# Altium schematic sheet ETH-PHY_SGMII.SchDoc
size A4; Organization: UltraZohm; SheetNumber: 11; SheetTotal: 15
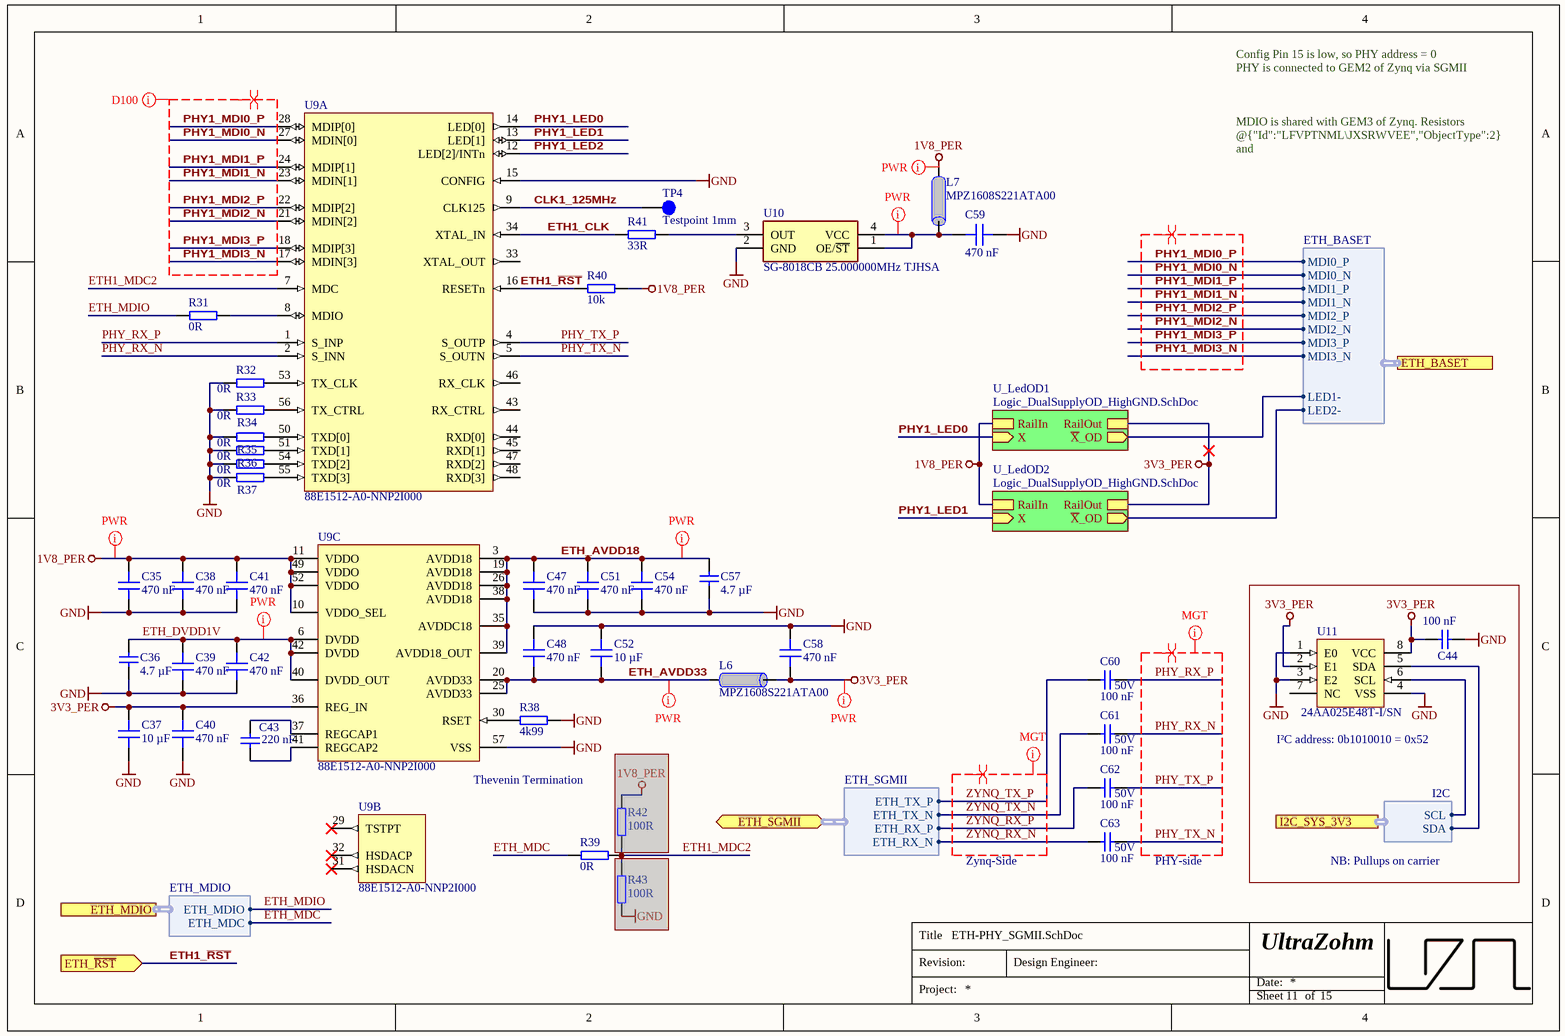
[diagram p0: ETH-PHY_SGMII.SchDoc]

## Parts
C35  470 nF  [C_0603_TE]
C36  4.7 µF  [C_0603_TE]
C37  10 µF  [C_0603_TE]
C38  470 nF  [C_0603_TE]
C39  470 nF  [C_0603_TE]
C40  470 nF  [C_0603_TE]
C41  470 nF  [C_0603_TE]
C42  470 nF  [C_0603_TE]
C43  220 nF  [C_0603_TE]
C44  100 nF  [C_0603_TE]
C47  470 nF  [C_0603_TE]
C48  470 nF  [C_0603_TE]
C51  470 nF  [C_0603_TE]
C52  10 µF  [C_0603_TE]
C54  470 nF  [C_0603_TE]
C57  4.7 µF  [C_0603_TE]
C58  470 nF  [C_0603_TE]
C59  470 nF  [C_0603_TE]
C60  100 nF  Voltage: 50V  [C_0402_TE]
C61  100 nF  Voltage: 50V  [C_0402_TE]
C62  100 nF  Voltage: 50V  [C_0402_TE]
C63  100 nF  Voltage: 50V  [C_0402_TE]
L6  MPZ1608S221ATA00  [RES 0603_1608]
L7  MPZ1608S221ATA00  [RES 0603_1608]
R31  0R  [R_0603_TE]
R32  0R  [R_0603_TE]
R33  0R  [R_0603_TE]
R34  0R  [R_0603_TE]
R35  0R  [R_0603_TE]
R36  0R  [R_0603_TE]
R37  0R  [R_0603_TE]
R38  4k99  [RES 0603_1608]
R39  0R  [R_0603_TE]
R40  10k  [R_0603_TE]
R41  33R  [R_0603_TE]
R42  100R  [R_0603_TE]  (masked out: inside a compile mask, not in the netlist)
R43  100R  [R_0603_TE]  (masked out: inside a compile mask, not in the netlist)
TP4  Testpoint 1mm  [TP_1mm]  (no BOM)
U9  88E1512-A0-NNP2I000  [QFN50P800X800X100-57N]  (parts A,B,C of 3)
U10  SG-8018CB 25.000000MHz TJHSA  [SMD5032-4P]
U11  24AA025E48T-I/SN  [D0008A_N]

## Sub-sheets
U_LedOD1 = Logic_DualSupplyOD_HighGND.SchDoc: RailIn, RailOut, X (in), ~{X}_OD (out)
U_LedOD2 = Logic_DualSupplyOD_HighGND.SchDoc: RailIn, RailOut, X (in), ~{X}_OD (out)

## Ports
ETH_BASET (harness ETH_BASET), ETH_MDIO (harness ETH_MDIO), ETH_SGMII (bidir, harness ETH_SGMII), ETH_~{RST} (in), I2C_SYS_3V3 (harness I2C)

## Harnesses
ETH_SGMII: ETH_RX_N, ETH_RX_P, ETH_TX_N, ETH_TX_P
ETH_MDIO: ETH_MDC, ETH_MDIO
ETH_BASET: MDI0_P, MDI0_N, MDI1_P, MDI1_N, MDI2_P, MDI2_N, MDI3_P, MDI3_N, LED1-, LED2-
I2C: SCL, SDA

## Nets
1V8_PER: C35.1 C38.1 C41.1 L7.1 R40.2 U9.10(VDDO_SEL) U9.11(VDDO) U9.49(VDDO) U9.52(VDDO) ; sheet U_LedOD1/RailIn, sheet U_LedOD2/RailIn
3V3_PER: C37.1 C40.1 C44.1 C58.2 L6.2 U9.36(REG_IN) U11.2(E1) U11.8(VCC) ; sheet U_LedOD1/RailOut, sheet U_LedOD2/RailOut
GND: C35.2 C36.2 C37.2 C38.2 C39.2 C40.2 C41.2 C42.2 C44.2 C47.2 C48.1 C51.2 C52.1 C54.2 C57.2 C58.1 C59.1 R32.1 R33.1 R34.1 R35.1 R36.1 R37.1 R38.1 U9.15(CONFIG) U9.57(VSS) U10.2(GND) U11.1(E0) U11.3(E2) U11.4(VSS)
CLK1_125MHz: TP4.1 U9.9(CLK125)
ETH1_CLK: R41.1 U9.34(XTAL_IN)
ETH1_MDC2: R39.2 U9.7(MDC)
ETH1_~{RST}: R40.1 U9.16(RESETn) ; port ETH_~{RST}
ETH_AVDD18: C47.1 C51.1 C54.1 C57.1 U9.3(AVDD18) U9.19(AVDD18) U9.26(AVDD18) U9.35(AVDDC18) U9.38(AVDD18) U9.39(AVDD18_OUT)
ETH_AVDD33: C48.2 C52.2 L6.1 U9.20(AVDD33) U9.25(AVDD33)
ETH_DVDD1V: C36.1 C39.1 C42.1 U9.6(DVDD) U9.40(DVDD_OUT) U9.42(DVDD)
ETH_MDC: R39.1 ; port ETH_MDIO.ETH_MDC
ETH_MDIO: R31.1 ; port ETH_MDIO.ETH_MDIO
PHY1_LED0: U9.14(LED[0]) ; sheet U_LedOD1/X
PHY1_LED1: U9.13(LED[1]) ; sheet U_LedOD2/X
PHY1_LED2: U9.12(LED[2]/INTn)
PHY1_MDI0_N: U9.27(MDIN[0]) ; port ETH_BASET.MDI0_N
PHY1_MDI0_P: U9.28(MDIP[0]) ; port ETH_BASET.MDI0_P
PHY1_MDI1_N: U9.23(MDIN[1]) ; port ETH_BASET.MDI1_N
PHY1_MDI1_P: U9.24(MDIP[1]) ; port ETH_BASET.MDI1_P
PHY1_MDI2_N: U9.21(MDIN[2]) ; port ETH_BASET.MDI2_N
PHY1_MDI2_P: U9.22(MDIP[2]) ; port ETH_BASET.MDI2_P
PHY1_MDI3_N: U9.17(MDIN[3]) ; port ETH_BASET.MDI3_N
PHY1_MDI3_P: U9.18(MDIP[3]) ; port ETH_BASET.MDI3_P
PHY_RX_N: C61.2 U9.2(S_INN)
PHY_RX_P: C60.2 U9.1(S_INP)
PHY_TX_N: C63.2 U9.5(S_OUTN)
PHY_TX_P: C62.2 U9.4(S_OUTP)
ZYNQ_RX_N: C63.1 ; port ETH_SGMII.ETH_RX_N
ZYNQ_RX_P: C62.1 ; port ETH_SGMII.ETH_RX_P
ZYNQ_TX_N: C61.1 ; port ETH_SGMII.ETH_TX_N
ZYNQ_TX_P: C60.1 ; port ETH_SGMII.ETH_TX_P
NetC43_1: C43.1 U9.37(REGCAP1)
NetC43_2: C43.2 U9.41(REGCAP2)
NetC59_2: C59.2 L7.2 U10.1(OE/~{ST}) U10.4(VCC)
NetR31_2: R31.2 U9.8(MDIO)
NetR32_2: R32.2 U9.53(TX_CLK)
NetR33_2: R33.2 U9.56(TX_CTRL)
NetR34_2: R34.2 U9.50(TXD[0])
NetR35_2: R35.2 U9.51(TXD[1])
NetR36_2: R36.2 U9.54(TXD[2])
NetR37_2: R37.2 U9.55(TXD[3])
NetR38_2: R38.2 U9.30(RSET)
NetR41_2: R41.2 U10.3(OUT)
NetU11_5: U11.5(SDA) ; port I2C_SYS_3V3.SDA
NetU11_6: U11.6(SCL) ; port I2C_SYS_3V3.SCL
(unnamed): sheet U_LedOD1/~{X}_OD, port ETH_BASET.LED1-
(unnamed): sheet U_LedOD2/~{X}_OD, port ETH_BASET.LED2-

Not connected (* = marked no-connect by the designer): U9 29(TSTPT)* 31(HSDACN)* 32(HSDACP)* 33(XTAL_OUT) 43(RX_CTRL) 44(RXD[0]) 45(RXD[1]) 46(RX_CLK) 47(RXD[2]) 48(RXD[3]); U11 7(NC)

## Layout directives
differential pair: PHY1_MDI0_N, PHY1_MDI0_P, PHY1_MDI1_N, PHY1_MDI1_P, PHY1_MDI2_N, PHY1_MDI2_P, PHY1_MDI3_N, PHY1_MDI3_P, PHY_RX_N, PHY_RX_P, PHY_TX_N, PHY_TX_P, ZYNQ_RX_N, ZYNQ_RX_P, ZYNQ_TX_N, ZYNQ_TX_P
net class D100: PHY1_MDI0_N, PHY1_MDI0_P, PHY1_MDI1_N, PHY1_MDI1_P, PHY1_MDI2_N, PHY1_MDI2_P, PHY1_MDI3_N, PHY1_MDI3_P
net class MGT: PHY_RX_N, PHY_RX_P, PHY_TX_N, PHY_TX_P, ZYNQ_RX_N, ZYNQ_RX_P, ZYNQ_TX_N, ZYNQ_TX_P
net class PWR: 1V8_PER, 3V3_PER, ETH_AVDD18, ETH_AVDD33, ETH_DVDD1V, NetC59_2

## Notes on the sheet
- Config Pin 15 is low, so PHY address = 0
  PHY is connected to GEM2 of Zynq via SGMII
  MDIO is shared with GEM3 of Zynq. Resistors @{"Id":"LFVPTNML\JXSRWVEE","ObjectType":2} and @{"Id":"LFVPTNML\HYAPWXBM","ObjectType":2} need to be soldered with 0R to be connected to the MDIO Bus
- Thevenin Termination
- (near U11) I²C address: 0b1010010 = 0x52
- Zynq-Side
- (near C63) PHY-side
- NB: Pullups on carrier
- Title
- Revision:
- Design Engineer:
- Date:
- Project:
- Sheet
- of

## Library data of the parts
C35 C38-C42 C47 C48 C51 C54 C58 C59 = CL10A474KB8NNNC: Capacitor 0603, 50 VDC, 470 nF, X5R; Manufacturer: Samsung Electro-Mechanics; Tolerance: 10 %; Voltage Rating: 50 VDC; Created from: AGeiger; Manufacturer Part Number: CL10A474KB8NNNC; PartID: 103; Created On: 22/08/2022 14:44:45; ComponentLink1Description: Datasheet; ComponentLink1URL: https://datasheet.lcsc.com/lcsc/1810191213_Samsung-Electro-Mechanics-CL10A474KB8NNNC_C170149.pdf; Component Type: Capacitor 0603; Device Package: 0603; Last Updated: 22/04/2025 15:48:45; Mounting Type: SMD; Operating Temperature: -55 - 85°C; Series: X5R; Supplier 1: LCSC; Supplier Part Number 1: C170149; Supplier 2: Mouser; Supplier Part Number 2: 187-CL10A474KB8NNNC; Type: Capacitor; Value: 470 nF; Live Cycle Status: 1; LCSC Part Number: C170149
C36 C57 = UZgen_C_0603_4.7uF_16V_X5R: Generic capacitor; Manufacturer: UZgen; Tolerance: 10 %; Created from: MGeier; Voltage: 16V; Manufacturer Part Number: UZgen_C_0603_4.7uF_16V_X5R; PartID: 5809; Created On: 20/03/2025 14:43:45; Device Package: 0603; Last Updated: 20/03/2025 14:43:45; Mounting Type: SMD; Value: 4.7 µF; Technology: X5R
C37 C52 = CL10A106MO8NQNC: Capacitor 0603, 16 VDC, 10 µF, X5R; Manufacturer: Samsung Electro-Mechanics; Tolerance: 20 %; Voltage Rating: 16 VDC; Created from: AGeiger; Manufacturer Part Number: CL10A106MO8NQNC; PartID: 101; Created On: 22/08/2022 13:56:44; ComponentLink1Description: Datasheet; ComponentLink1URL: https://datasheet.lcsc.com/lcsc/1810261909_Samsung-Electro-Mechanics-CL10A106MO8NQNC_C92487.pdf; Component Type: Capacitor 0603; Device Package: 0603; Last Updated: 19/11/2024 12:40:46; Mounting Type: SMD; Operating Temperature: -55 - 85°C; Series: X5R; Supplier 1: LCSC; Supplier Part Number 1: C92487; Type: Capacitor; Value: 10 µF; Live Cycle Status: 1; LCSC Part Number: C92487
C43 = UZgen_C_0603_220nF_50V_X7R: Generic capacitor; Manufacturer: UZgen; Tolerance: 10 %; Voltage: 50V; Created from: UZgenTool; Value: 220 nF; Technology: X7R; Manufacturer Part Number: UZgen_C_0603_220nF_50V_X7R; PartID: 2; Created On: 02/07/2024 14:42:23; Device Package: 0603; Mounting Type: SMD; Last Updated: 08/08/2024 15:01:15
C44 = UZgen_C_0603_100nF_50V_X7R: Generic capacitor; Manufacturer: UZgen; Voltage: 50V; Tolerance: 10 %; Created from: AGeiger; Manufacturer Part Number: UZgen_C_0603_100nF_50V_X7R; PartID: 1; Created On: 02/07/2024 14:42:23; Value: 100 nF; Device Package: 0603; Technology: X7R; Mounting Type: SMD; Last Updated: 08/08/2024 15:01:15
C60-C63 = UZgen_C_0402_100nF_50V_X7R: Generic capacitor; Manufacturer: UZgen; Tolerance: 10 %; Created from: UZgenTool; Technology: X7R; Value: 100 nF; Manufacturer Part Number: UZgen_C_0402_100nF_50V_X7R; PartID: 3431; Created On: 02/08/2024 11:17:51; Device Package: 0402; Mounting Type: SMD; Last Updated: 02/08/2024 11:17:51
L6 L7 = MPZ1608S221ATA00: Ferritperle, 0603, 220 ohm, 2.2 A, Baureihe MPZ, 0.05 ohm, ± 25%; Manufacturer: TDK; Value: 220 Ohm; Type: Ferrite; DC current: 2.2 A; Created from: MGremer; Manufacturer Part Number: MPZ1608S221ATA00; PartID: 3; Created On: 08/06/2021 11:33:39; ComponentLink1Description: Datasheet; ComponentLink1URL: http://www.farnell.com/datasheets/2291439.pdf; Component Type: Ferritperle; Device Package: 0603; Last Updated: 12/07/2024 17:26:54; Mounting Type: SMD; Operating Temperature: -55 - 125 °C; Series: MPZ; Supplier 1: Farnell; Supplier Part Number 1: 1301677RL; Live Cycle Status: 1; LCSC Part Number: C76815; Stock number: not stored
R31-R37 R39 = UZgen_R_0603_0R: Generic resistor; Manufacturer: UZgen; Tolerance: 1 %; Created from: UZgenTool; Value: 0R; Manufacturer Part Number: UZgen_R_0603_0R; PartID: 581; Created On: 08/07/2024 14:34:30; Device Package: 0603; Mounting Type: SMD; Last Updated: 08/07/2024 14:34:30
R38 = RC0603FR-074K99L: 100mW Thick Film Resistors 75V ±100ppm/℃ ±1% 4.99kΩ 0603 Chip Resistor - Surface Mount ROHS; Manufacturer: YAGEO; Created from: NDiringer; Tolerance: 1%; Value: 4k99; Manufacturer Part Number: RC0603FR-074K99L; PartID: 352; Created On: 17/08/2022 08:08:34; ComponentLink1Description: Datasheet; ComponentLink1URL: https://www.lcsc.com/datasheet/lcsc_datasheet_2304140030_YAGEO-RC0603FR-074K99L_C114621.pdf; Component Type: SMD resistor; Device Package: 0603; Last Updated: 17/08/2022 08:08:34; Mounting Type: SMD; Supplier 1: LCSC/JLCPCB; Supplier Part Number 1: C114621; Type: Resistor; Live Cycle Status: 1; Stock number: not stored; LCSC Part Number: C114621
R40 = UZgen_R_0603_10k: Generic resistor; Manufacturer: UZgen; Tolerance: 1 %; Created from: AGeiger; Value: 10k; Manufacturer Part Number: UZgen_R_0603_10k; PartID: 1; Created On: 02/07/2024 14:34:53; Device Package: 0603; Mounting Type: SMD; Last Updated: 02/07/2024 14:37:16
R41 = UZgen_R_0603_33R: Generic resistor; Manufacturer: UZgen; Tolerance: 1 %; Created from: UZgenTool; Value: 33R; Manufacturer Part Number: UZgen_R_0603_33R; PartID: 185; Created On: 02/07/2024 17:29:48; Device Package: 0603; Mounting Type: SMD; Last Updated: 02/07/2024 17:29:48
R42 R43 = UZgen_R_0603_100R: Generic resistor; Manufacturer: UZgen; Tolerance: 1 %; Created from: UZgenTool; Value: 100R; Manufacturer Part Number: UZgen_R_0603_100R; PartID: 197; Created On: 02/07/2024 17:29:48; Device Package: 0603; Mounting Type: SMD; Last Updated: 02/07/2024 17:29:48
TP4 = NULL: Manufacturer Part Number: NULL; Created from: AGeiger; Created: 2018_06_25_AGeiger; Value: Testpoint 1mm; PartID: 9; Created On: 20/09/2022 13:14:57; Component Type: Testpoint; Last Updated: 20/09/2022 13:15:39; Manufacturer: NULL; Supplier 1: NULL; Supplier Part Number 1: NULL; Type: Testpoint; Live Cycle Status: 1
U9 = 88E1512-A0-NNP2I000: Ethernet ICs Single-Port EEE GE PHY w/SGMII in 56-pin QFN; Manufacturer: Marvell; Created from: MGremer; Manufacturer Part Number: 88E1512-A0-NNP2I000; PartID: 1; Created On: 01/12/2020 16:21:41; ComponentLink1Description: Datasheet; ComponentLink1URL: https://www.mouser.de/datasheet/2/912/marvell-phys-transceivers-alaska-88e151x-datasheet-1360912.pdf; Component Type: Ethernet Single-Port; Device Package: QFN65; Last Updated: 26/06/2024 13:40:11; Mounting Type: SMD; Supplier 1: Mouser; Supplier Part Number 1: 348-88E1512A0NNP2I00; Type: Ethernet Single-Port; Live Cycle Status: 1; LCSC Part Number: C713256; Stock number: not stored
U10 = SG-8018CB 25.000000MHz TJHSA: ±50ppm 1.8V~3.3V 25MHz SMD5032-4P Programmable Oscillators ROHS; Manufacturer: Seiko Epson; Created from: FRosner; Manufacturer Part Number: SG-8018CB 25.000000MHz TJHSA; PartID: 3; Created On: 15/08/2024 10:38:39; ComponentLink1Description: Datasheet; ComponentLink1URL: https://download.epsondevice.com/td/pdf/app/SG-8018CB_en.pdf; Component Type: Oscillator; Device Package: 5032; Last Updated: 15/08/2024 10:38:39; Mounting Type: SMD; Operating Temperature: -40 to +105°C; Supplier 1: LCSC; Supplier Part Number 1: C390471; Value: 25 MHz; LCSC Part Number: C390471
U11 = 24AA025E48T-I/SN: 2Kbit I2C SOP-8 EEPROM ROHS; Manufacturer: Microchip Tech; Created from: FRosner; Manufacturer Part Number: 24AA025E48T-I/SN; PartID: 7; Created On: 07/09/2024 12:18:21; ComponentLink1Description: Datasheet; ComponentLink1URL: https://wmsc.lcsc.com/wmsc/upload/file/pdf/v2/lcsc/2202010930_Microchip-Tech-24AA025E48T-I-SN_C2060925.pdf; Component Type: EEPROM; Device Package: SOIC-8; Last Updated: 10/09/2024 09:33:15; Mounting Type: SMD; Operating Temperature: -40 to +85 °C; Series: 24AA025; Supplier 1: Mouser; Supplier Part Number 1: 579-24AA025E48T-I/SN; Supplier 2: LCSC; Supplier Part Number 2: C2060925; Type: Memory; Value: 24AA025E48T-I/SN; LCSC Part Number: C2060925